# Altium schematic sheet PowerRegulators.SchDoc: Power
size A; Revision: A; SheetNumber: 2; SheetTotal: 6; ECE315_Project_Name: ECE453 F25 Student Mezzanine Template
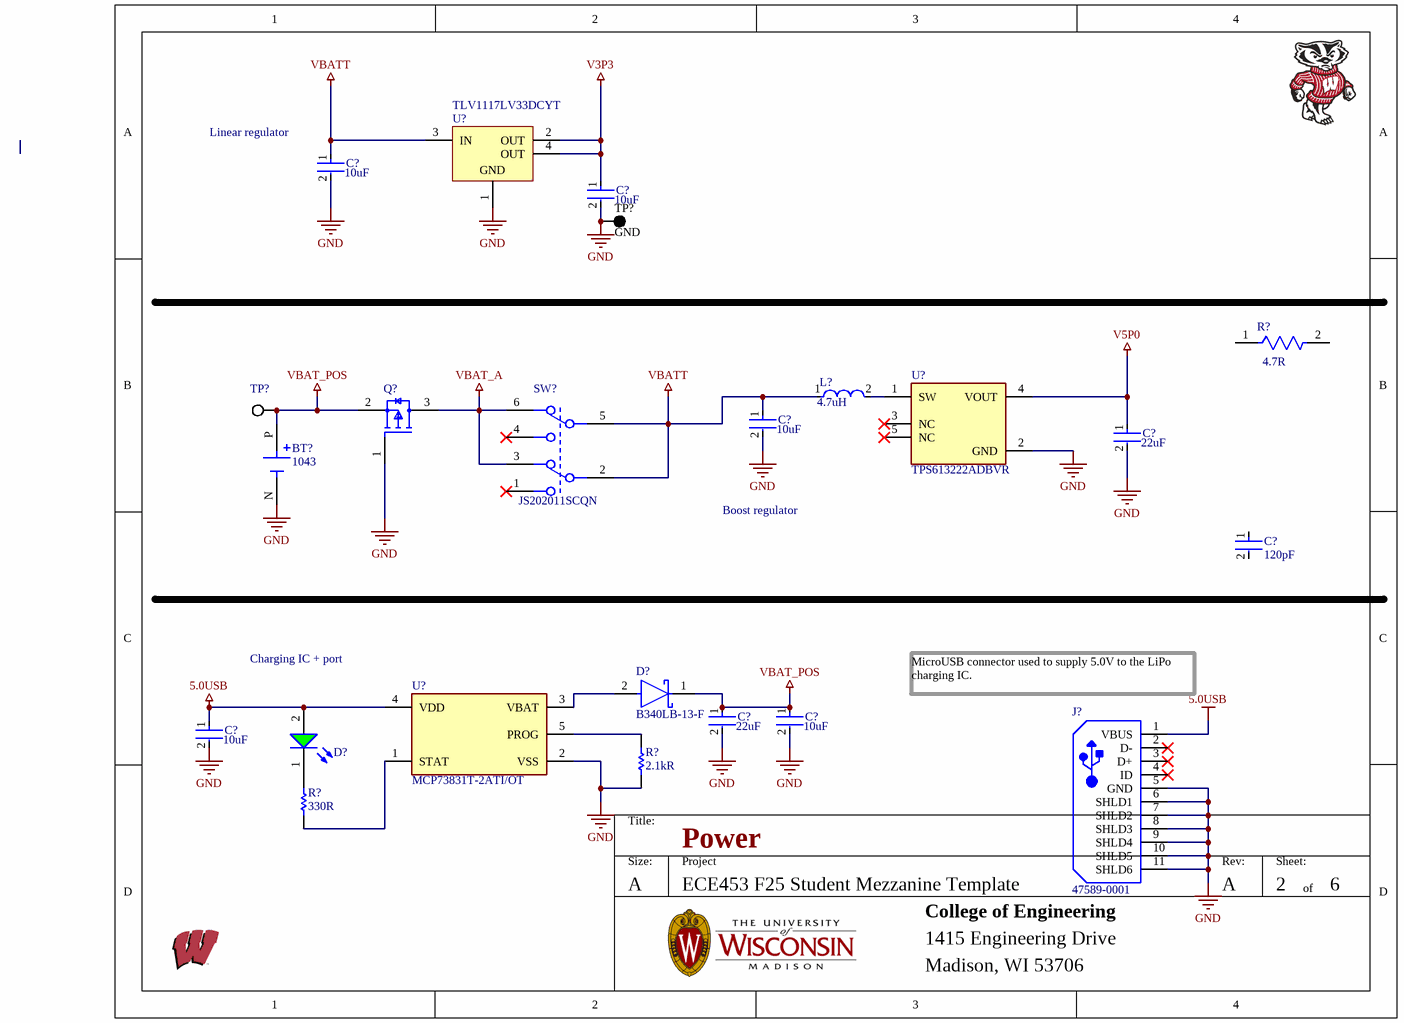
[diagram p0: PowerRegulators.SchDoc]

## Parts
(Parts that share a designator on the sheet are numbered #1, #2 ... from top to bottom, then left to right.)
BT?  1043  [BAT_1043]
C?#1  value 10uF  [FP-C0805C-DG-MFG]  (hidden comment: C0805C106K8PACTU)
C?#2  value 10uF  [FP-C0805C-DG-MFG]  (hidden comment: C0805C106K8PACTU)
C?#3  value 10uF  [FP-C0805C-DG-MFG]  (hidden comment: C0805C106K8PACTU)
C?#4  Capacitance: 22uF  [FP-CL21-IPC_C]  (hidden comment: CL21A226MOCLRNC)
C?#5  Capacitance: 120pF  [FP-CL21-IPC_C]  (hidden comment: CL21C121JDCNNNC)
C?#6  Capacitance: 22uF  [FP-CL21-IPC_C]  (hidden comment: CL21A226MOCLRNC)
C?#7  value 10uF  [FP-C0805C-DG-MFG]  (hidden comment: C0805C106K8PACTU)
C?#8  value 10uF  [FP-C0805C-DG-MFG]  (hidden comment: C0805C106K8PACTU)
D?#1  B340LB-13-F  [FP-SMB-MFG]
D?#2  150080GS75000  [WL-SMCW_0805_150080xx75000]  (value not drawn)
J?  47589-0001  [MOLX-47589-0001_V]
L?  value 4.7uH  [FP-DFE252012C-IPC_C]  (hidden comment: DFE252012P-4R7M=P2)
Q?  DMG2305UX-7  [FP-SOT23-IPC_B]  (value not drawn)
R?#1  Resistance: 4.7R  [FP-RMCF0805-MFG]  (hidden comment: RMCF0805JT4R70)
R?#2  value 330R  [RESC2013X60X40LL20T25]  (hidden comment: ERA6AEB331V)
R?#3  value 2.1kR  [RES_0805]  (hidden comment: RES_0805_K_002_10)
SW?  JS202011SCQN  [FP-JS202011SCQN-MFG]
TP?#1  GND  [KSTN-5011_V]
TP?#2  5019  [KSTN-5019_V]  (value not drawn)
U?#1  TLV1117LV33DCYT  [DCY0004A_M]
U?#2  TPS613222ADBVR  [FP-DBV0005A-MFG]
U?#3  MCP73831T-2ATI/OT  [FP-C04-091-OT-IPC_C]

## Nets
5.0USB: C?#8.1 D?#2.2(A) J?.1(VBUS) U?#3.4(VDD)
GND: BT?.N(NEG) C?#1.2 C?#2.2 C?#3.2 C?#4.2 C?#6.2 C?#7.2 C?#8.2 J?.5(GND) J?.6(SHLD1) J?.7(SHLD2) J?.8(SHLD3) J?.9(SHLD4) J?.10(SHLD5) J?.11(SHLD6) Q?.1(GATE) R?#3.1 TP?#1.1 U?#1.1(GND) U?#2.2(GND) U?#3.2(VSS)
V3P3: C?#2.1 U?#1.2(OUT) U?#1.4(OUT)
V5P0: C?#4.1 U?#2.4(VOUT)
VBAT_A: Q?.3(DRAIN) SW?.3 SW?.6
VBAT_POS: BT?.P(POS) C?#6.1 C?#7.1 D?#1.1(C) Q?.2(SOURCE) TP?#2.1
VBATT: C?#1.1 C?#3.1 L?.1 SW?.2 SW?.5 U?#1.3(IN)
NetD?#1_2: D?#1.2(A) U?#3.3(VBAT)
NetD?#2_1: D?#2.1(K) R?#2.1
NetL?_2: L?.2 U?#2.1(SW)
NetR?#2_2: R?#2.2 U?#3.1(STAT)
NetR?#3_2: R?#3.2 U?#3.5(PROG)

Not connected (* = marked no-connect by the designer): C?#5 1 2; J? 2(D-)* 3(D+)* 4(ID)*; R?#1 1 2; SW? 1* 4*; U?#2 3(NC)* 5(NC)*

## Notes on the sheet
- (near C?#1) Linear regulator
- Boost regulator
- Charging IC + port
- (near J?) MicroUSB connector used to supply 5.0V to the LiPo charging IC.
- Title:
- Size:
- A
- Project
- Rev:
- Sheet:
- of
- College of Engineering
- 1415 Engineering Drive
- Madison, WI 53706

## Library data of the parts
BT? = 1043: Manufacturer: Keystone Electronics; Price: None; Availability: Unavailable; Value: *; MP: 1043; Package: None; Supplier: Digikey; Supplier Part Number: 36-1043-ND; Manufacturer Part Number: 1043; RoHS: Yes; Category: Batteries and Accessories; Stock: 4625; Pricing: 1=3.38, 25=2.604, 100=2.328, 250=2.16176, 500=2.04398, 1000=1.9326, 2500=1.79464, 5000=1.69686 (USD); ComponentLink1URL: https://datasheet.ciiva.com/4/1043-4710.pdf?src-supplier=Digikey; ComponentLink1Description: https://datasheet.ciiva.com/4/1043-4710.pdf?src-supplier=Digikey; ComponentLink2URL: https://datasheet.ciiva.com/3353/1043-eng-tds-3353208.pdf?src-supplier=Distrelec; ComponentLink2Description: https://datasheet.ciiva.com/3353/1043-eng-tds-3353208.pdf?src-supplier=Distrelec; ComponentLink3URL: https://datasheet.ciiva.com/41803/1043-41803215.pdf?src-supplier=Digikey; ComponentLink3Description: https://datasheet.ciiva.com/41803/1043-41803215.pdf?src-supplier=Digikey; ComponentLink4URL: https://datasheet.ciiva.com/4642/1043-4642493.pdf?src-supplier=Mouser; ComponentLink4Description: https://datasheet.ciiva.com/4642/1043-4642493.pdf?src-supplier=Mouser
C?#1-C?#3 C?#7 C?#8 = CMP-2007-03243-2: CAP CER 10UF 10V X5R 0805; Manufacturer: KEMET; Dielectric Material: Ceramic; Material: 4241ConductorMaterial; Tolerance: 10%; ComponentLink2URL: https://content.kemet.com/datasheets/KEM_C1006_X5R_SMD.pdf; ComponentLink2Description: Datasheet; Supplier: Digikey; Supplier Part Number: 399-C0805C106K8PAC7800CT-ND; Manufacturer Part Number: C0805C106K8PACTU; RoHS: Yes; Category: Ceramic Capacitors; Stock: 5202928; Pricing: 1=0.14, 10=0.098, 50=0.0584, 100=0.0459, 500=0.03388, 1000=0.02805 (USD); Mounting Technology: Surface Mount; Case/Package: 0805; Pins: 2; Contact Plating: Tin,Matte; Case Code (Imperial): 0805; Case Code (Metric): 2012; Min Operating Temperature: -55°C; Max Operating Temperature: 85°C; Packaging: Tape and Reel; Dielectric: X5R; Voltage Rating (DC): 10V; Termination: SMD/SMT; Package Quantity: 1; Voltage Rating: 10V; Voltage: 10V; Dissipation Factor: 10%; Series: C; Construction: Flat; Length: 2mm; Width: 0.049inch; Height: 1.25mm; Depth: 1.25mm; Thickness: 0.055inch; Radiation Hardening: No; Reach SVHC Compliant: No; Lead Free: Lead Free; RoHS Compliant: Yes; ComponentLink1URL: https://datasheet.ciiva.com/22704/1732709-22704859.pdf?src-supplier=Element14; ComponentLink1Description: https://datasheet.ciiva.com/22704/1732709-22704859.pdf?src-supplier=Element14; ComponentLink3URL: https://datasheet.ciiva.com/7842/1732709-7842198.pdf?src-supplier=Element14; ComponentLink3Description: https://datasheet.ciiva.com/7842/1732709-7842198.pdf?src-supplier=Element14; ComponentLink4URL: https://datasheet.ciiva.com/7842/40889-7842552.pdf?src-supplier=Element14; ComponentLink4Description: https://datasheet.ciiva.com/7842/40889-7842552.pdf?src-supplier=Element14
C?#4 C?#6 = CMP-13271-002990-1: CL21 Series 0805 22uF 16V ±20% Tolerance X5R Multilayer Ceramic Chip Capacitor; Case Code (Imperial): 0805; Max Operating Temperature: 85°C; Min Operating Temperature: -55°C; Packaging: Tape and Reel; Case Code (Metric): 2012; Case/Package: 0805; Mount: Surface Mount; Tolerance: 20%; Thickness: 0.037inch; Voltage Rating: 16V; Width: 0.049inch; Length: 0.079inch; Supplier: Digikey; Supplier Part Number: 1276-6780-1-ND
C?#5 = CMP-13271-002834-1: CL21 Series 0805 120pF 200V ±5% Tolerance C0G Multilayer Ceramic Chip Capacitor; Case Code (Imperial): 0805; Depth: 1.25mm; Voltage Rating (DC): 200V; Radiation Hardening: No; Packaging: Tape and Reel; Case/Package: 0805; Tolerance: 5%; Height: 0.85mm; Min Operating Temperature: -55°C; Thickness: 0.037inch; Max Operating Temperature: 125°C; Mount: Surface Mount; Package Quantity: 1; Dielectric: C0G; Case Code (Metric): 2012; Length: 2mm; Lead Free: Lead Free; Width: 0.049inch; Voltage Rating: 200V; Supplier: Digikey; Supplier Part Number: 1276-1201-1-ND
D?#1 = CMP-12790-000022-1: DIODE SCHOTTKY 40V 3A SMB; Manufacturer: Diodes Inc.; Max Surge Forward Current: 70A; Value: 180pF; Peak Reverse Current: 2mA; Standoff Height: 0.05mm; Max Junction Temp: +150°C; Forward Voltage: 450mV; Polarity: Standard; Device Class L2: Diodes; Octopart: https://octopart.com/b340lb-13-f-diodes+inc.-325823; Device Class L1: Discrete Semiconductors; Forward Current: 3A; Automotive: No; Manufacturer Part Number: B340LB-13-F; Temperature: -55°C to +150°C; Temperature Range Low: -55°C; Max Repetitive Reverse Voltage: 40V; Device Class L3: Schottky Diodes; RoHS: TRUE; Height: 2.5mm; ComponentLink2URL: https://www.diodes.com/assets/Datasheets/ds30240.pdf; Package: SMB; Digikey Description: DIODE SCHOTTKY 40V 3A SMB; Lead Free: Yes; Category: Diode; Reverse Voltage: 40V; Mouser Description: Schottky Diodes & Rectifiers 40V 3A; ComponentLink2Description: Datasheet; Footprint Url: https://www.diodes.com/assets/Package-Files/SMB.pdf; Temperature Range High: +150°C; Capacitance: 180pF; Supplier: Digikey; Supplier Part Number: B340LB-FDICT-ND; Stock: 98066; Pricing: 1=0.42, 10=0.357, 100=0.2482, 500=0.19376, 1000=0.15748 (USD); Mounting Technology: Surface Mount; Case/Package: SMB; Pins: 2; Weight: 0.00328oz; Min Operating Temperature: -55°C; Max Operating Temperature: 125°C; Max Reverse Current: 2mA; Max Repetitive Reverse Voltage (Vrrm): 40V; Peak Non-Repetitive Surge Current: 70A; Package Quantity: 3000; Packaging: Tape and Reel; Average Rectified Current: 3A; Max Forward Surge Current (Ifsm): 70A; Termination: SMD/SMT; Voltage Rating (DC): 40V; Current Rating: 3A; Output Current: 3A; Current: 3A; Voltage: 40V; Max Reverse Voltage (DC): 40V; Series: -; Length: 4.57mm; Width: 3.94mm; Radiation Hardening: No; Reach SVHC Compliant: No; RoHS Compliant: Yes; ComponentLink1URL: https://datasheet.ciiva.com/4715/ds30240-71143-4715794.pdf?src-supplier=Mouser; ComponentLink1Description: https://datasheet.ciiva.com/4715/ds30240-71143-4715794.pdf?src-supplier=Mouser; ComponentLink3URL: https://datasheet.ciiva.com/26949/getdatasheetpartid-146318-26949355.pdf?src-supplier=Verical; ComponentLink3Description: https://datasheet.ciiva.com/26949/getdatasheetpartid-146318-26949355.pdf?src-supplier=Verical; ComponentLink4URL: https://datasheet.ciiva.com/8303/ds30240-8303077.pdf?src-supplier=Avnet; ComponentLink4Description: https://datasheet.ciiva.com/8303/ds30240-8303077.pdf?src-supplier=Avnet; ComponentLink5URL: https://datasheet.ciiva.com/914/ds30240-914106.pdf?src-supplier=Digikey; ComponentLink5Description: https://datasheet.ciiva.com/914/ds30240-914106.pdf?src-supplier=Digikey; ComponentLink6URL: https://datasheet.ciiva.com/914/ds30240-914107.pdf?src-supplier=Digikey; ComponentLink6Description: https://datasheet.ciiva.com/914/ds30240-914107.pdf?src-supplier=Digikey; ComponentLink7URL: https://datasheet.ciiva.com/914/ds30240-914108.pdf?src-supplier=Digikey; ComponentLink7Description: https://datasheet.ciiva.com/914/ds30240-914108.pdf?src-supplier=Digikey; ComponentLink8URL: https://datasheet.ciiva.com/16380/ds30240-16380877.pdf?src-supplier=Future+Electronics; ComponentLink8Description: https://datasheet.ciiva.com/16380/ds30240-16380877.pdf?src-supplier=Future+Electronics; ComponentLink9URL: https://datasheet.ciiva.com/1177/ds30240-1177479.pdf?src-supplier=Element14; ComponentLink9Description: https://datasheet.ciiva.com/1177/ds30240-1177479.pdf?src-supplier=Element14
D?#2 = CMP-1426-00007-2: LED GREEN CLEAR 0805 SMD; NexarPartId: 29717780; Manufacturer: Wurth Electronics; Wavelength: 520nm; Forward Current: 100mA; Lens Style: Clear, Rectangular; Dominant Wavelength: 525nm; Max Junction Temperature (Tj): 95°C; Power Dissipation: 105mW; Luminous Intensity: 450mcd; Peak Wavelength: 515nm; Viewing Angle: 140°; Test Current: 20mA; Reverse Voltage: 5V; Forward Voltage: 3.2V; Lens Color: Colorless; Lens Size: 1.25mm; Mount: Surface Mount; REACH SVHC: Unknown; Min Operating Temperature: -40°C; Case Code (Imperial): 0805; Case/Package: 0805; Max Operating Temperature: 85°C; RoHS: Compliant; Length: 2mm; Height: 700µm; Width: 1.25mm; Color: Green; Case Code (Metric): 2012; Packaging: Tape and Reel; Max Reverse Voltage (DC): 5V; Supplier: Digikey; Supplier Part Number: 732-4983-1-ND; Manufacturer Part Number: 150080GS75000; Category: LEDs; Stock: 34895; Pricing: 1=0.19, 50=0.176, 100=0.151, 500=0.131 (USD); Mounting Technology: Surface Mount; Package Quantity: 1; Series: WL-SMCW; Lens Transparency: Clear; RoHS Compliant: Yes; Reach SVHC Compliant: Unknown; ComponentLink1URL: https://datasheet.ciiva.com/29563/150080gs75000-29563008.pdf?src-supplier=Digikey; ComponentLink1Description: https://datasheet.ciiva.com/29563/150080gs75000-29563008.pdf?src-supplier=Digikey; ComponentLink2URL: https://datasheet.ciiva.com/29279/759434-da-01-en-chipled-0805-w-kl-gruen-150080gs75000-29279039.pdf?src-supplier=Conrad; ComponentLink2Description: https://datasheet.ciiva.com/29279/759434-da-01-en-chipled-0805-w-kl-gruen-150080gs75000-29279039.pdf?src-supplier=Conrad
J? = CMP-2000-05610-1: Right Angle Female Type AB Micro USB Connector, 30 V, 1.8 A, -30 to 85 degC, RoHS, Tape and Reel; Number of Ports: 1Port; Current Rating: 1.8A; Brand: Molex; Connector Type: MicroUSBTypeABreceptacle; Number of Contacts: 5Contact; Voltage Rating: 30VAC; Plating: 157ConductorMaterial; Max Voltage Rating (AC): 100V; Contact Resistance: 40mR; Voltage Rating (AC): 30V; USB Standard: USB 2.0; Number of Circuits: 5NUMBER; Pitch: 0.65mm; Color: Black; Product: MicroUSBTypeABConnectors; Package URL: http://www.molex.com/pdm_docs/sd/475890001_sd.pdf; Contact Plating: Gold; Datasheet URL: http://www.molex.com/webdocs/datasheets/pdf/en-us/0475890001_IO_CONNECTORS.pdf; Operating Temperature Range: -20Cto+85C; Termination Style: SMD/SMT; Mounting Angle: Right; Package Reference: 47589-0001; Gender: Female; Package Description: Micro USB Connector, Pitch 0.65 mm, 5 Positions, Body 7.5 x 5.6 mm; Mounting Technology: SurfaceMount; Contact Material: CopperAlloy; Packaging: Reel; RoHS: True; Standard: USB; Manufacturer URL: http://www.molex.com/; Manufacturer: Molex; Datasheet Version: 12/2016; Product Category: USBConnectors; Series: 47589; Supplier: Digikey; Supplier Part Number: WM17143CT-ND; Manufacturer Part Number: 47589-0001; Category: USB Connectors; Stock: 36685; Pricing: 1=0.86, 10=0.714, 100=0.5953 (USD); Housing Material: Polymer; Min Operating Temperature: -20°C; Max Operating Temperature: 85°C; Termination: Solder; Orientation: Right Angle; Number of Rows: 1NUMBER; Length: 8.65mm; Radiation Hardening: No; RoHS Compliant: Yes; Reach SVHC Compliant: Unknown; ComponentLink1URL: https://datasheet.ciiva.com/1098/1597783-1098478.pdf?src-supplier=Element14; ComponentLink1Description: https://datasheet.ciiva.com/1098/1597783-1098478.pdf?src-supplier=Element14; ComponentLink2URL: https://datasheet.ciiva.com/11731/0900766b80dfe0a8-11731295.pdf?src-supplier=Rs; ComponentLink2Description: https://datasheet.ciiva.com/11731/0900766b80dfe0a8-11731295.pdf?src-supplier=Rs; ComponentLink3URL: https://datasheet.ciiva.com/15181/getdatasheetpartid-158670-15181214.pdf?src-supplier=Verical; ComponentLink3Description: https://datasheet.ciiva.com/15181/getdatasheetpartid-158670-15181214.pdf?src-supplier=Verical; ComponentLink4URL: https://datasheet.ciiva.com/16148/0475890001-io-connectors-16148921.pdf?src-supplier=Onlinecomponents.com; ComponentLink4Description: https://datasheet.ciiva.com/16148/0475890001-io-connectors-16148921.pdf?src-supplier=Onlinecomponents.com; ComponentLink5URL: https://datasheet.ciiva.com/32371/0475890001-io-connectors-32371755.pdf?src-supplier=Onlinecomponents.com; ComponentLink5Description: https://datasheet.ciiva.com/32371/0475890001-io-connectors-32371755.pdf?src-supplier=Onlinecomponents.com
L? = CMP-06042-011776-1: Shielded Wirewound Inductor 4.7uH 20% 1400mA 0.2Ω 1008 (2520); Manufacturer: Murata; Core Material: Ferrite; Test Frequency: 1MHz; DC Resistance (DCR): 200mR; Max DC Current: 1.4A; Current Rating: 2A; Case Code (Metric): 2520; Case Code (Imperial): 1008; Inductance: 4.7uH; Mount: Surface Mount; Packaging: Tape and Reel; Depth: 2mm; Length: 0.098inch; Case/Package: 1008; Max Operating Temperature: 125°C; Shielding: Shielded; Width: 0.079inch; Height - Seated (Max): 0.047inch; Tolerance: 20%; Min Operating Temperature: -40°C; Resistor Type: Wirewound; Supplier: Digikey; Supplier Part Number: 490-10651-1-ND; Manufacturer Part Number: DFE252012P-4R7M=P2; RoHS: Yes; Category: Fixed Inductors; Stock: 3626; Pricing: 1=0.28, 10=0.228, 25=0.21, 50=0.1926, 100=0.1698, 250=0.1646, 500=0.14708, 1000=0.11907 (USD); Mounting Technology: Surface Mount; Series: DFE252012P; RoHS Compliant: Yes; ComponentLink1URL: http://www.farnell.com/datasheets/2550138.pdf?src-supplier=Farnell; ComponentLink1Description: http://www.farnell.com/datasheets/2550138.pdf?src-supplier=Farnell; ComponentLink2URL: http://www.murata.com/~/media/webrenewal/products/inductor/chip/tokoproducts/wirewoundmetalalloychiptype/m_dfe252012p.ashx?src-supplier=Digikey; ComponentLink2Description: http://www.murata.com/~/media/webrenewal/products/inductor/chip/tokoproducts/wirewoundmetalalloychiptype/m_dfe252012p.ashx?src-supplier=Digikey; ComponentLink3URL: https://www.murata.com/~/media/webrenewal/products/inductor/chip/tokoproducts/wirewoundmetalalloychiptype/m_dfe252012p.ashx?src-supplier=Digikey; ComponentLink3Description: https://www.murata.com/~/media/webrenewal/products/inductor/chip/tokoproducts/wirewoundmetalalloychiptype/m_dfe252012p.ashx?src-supplier=Digikey; ComponentLink4URL: http://www.toko.co.jp/products/pdf/inductors/dfe252012p.pdf?src-supplier=Avnet; ComponentLink4Description: http://www.toko.co.jp/products/pdf/inductors/dfe252012p.pdf?src-supplier=Avnet; ComponentLink5URL: https://datasheet.octopart.com/DFE252012P-4R7M%3DP2-Murata-Power-Solutions-datasheet-120059230.pdf?src-supplier=Future+Electronics; ComponentLink5Description: https://datasheet.octopart.com/DFE252012P-4R7M%3DP2-Murata-Power-Solutions-datasheet-120059230.pdf?src-supplier=Future+Electronics; ComponentLink6URL: http://www.farnell.com/datasheets/2550138.pdf?src-supplier=Newark; ComponentLink6Description: http://www.farnell.com/datasheets/2550138.pdf?src-supplier=Newark; ComponentLink7URL: https://datasheet.octopart.com/DFE252012P-4R7M%3DP2-Murata-datasheet-62290040.pdf?src-supplier=Element14; ComponentLink7Description: https://datasheet.octopart.com/DFE252012P-4R7M%3DP2-Murata-datasheet-62290040.pdf?src-supplier=Element14; ComponentLink8URL: https://datasheet.octopart.com/DFE252012P-4R7M%3DP2-Murata-datasheet-142045614.pdf?src-supplier=Arrow.cn; ComponentLink8Description: https://datasheet.octopart.com/DFE252012P-4R7M%3DP2-Murata-datasheet-142045614.pdf?src-supplier=Arrow.cn
Q? = CMP-1693-00002-4: MOSFET P-CH 20V 4.2A SOT23; Manufacturer: Diodes; Turn-On Delay Time: 10.8ns; Turn-Off Delay Time: 79.3ns; Threshold Voltage: -900mV; Rise Time: 13.7ns; Gate to Source Voltage (Vgs): 8V; Rds On Max: 52mR; Element Configuration: Single; Fall Time: 34.7ns; Max Power Dissipation: 1.4W; Drain to Source Resistance: 200mR; Number of Channels: 1; Input Capacitance: 808pF; Polarity: P-CHANNEL; Drain to Source Breakdown Voltage: -20V; Lead Free: Lead Free; Number of Pins: 3; Length: 3mm; Continuous Drain Current (ID): 4.2A; Contact Plating: Tin; Mount: Surface Mount; Weight: 0.000282oz; Min Operating Temperature: -55°C; Package Quantity: 3000; Drain to Source Voltage (Vdss): 20V; On-State Resistance: 52MR; Max Operating Temperature: 150°C; Height: 1.1mm; REACH SVHC: No SVHC; Packaging: Tape and Reel; Radiation Hardening: No; Case/Package: SOT-23; Width: 1.4mm; Supplier: Digikey; Supplier Part Number: DMG2305UX-7DICT-ND; Manufacturer Part Number: DMG2305UX-7; RoHS: Yes; Category: MOSFETs; Stock: 261910; Pricing: 1=0.39, 10=0.27, 100=0.1315, 500=0.10972, 1000=0.07623 (USD); Mounting Technology: Surface Mount; Pins: 3; Series: -; Drain-source On Resistance-Max: 52MR; Power Dissipation: 1.4W; Reach SVHC Compliant: No; RoHS Compliant: Yes; ComponentLink1URL: https://datasheet.ciiva.com/26993/dmg2305ux-26993544.pdf?src-supplier=Future+Electronics; ComponentLink1Description: https://datasheet.ciiva.com/26993/dmg2305ux-26993544.pdf?src-supplier=Future+Electronics
R?#1 = CMP-26527-005191-1: 4.7Ω ±5% 0.125W 0805 Thick Film Chip Resistor AEC-Q200 compliant; Temperature Coefficient: 200ppm/°C; Max Power Dissipation: 125mW; Height: 0.026inch; RoHS Compliant: Yes; Length: 0.079inch; Features: Automotive AEC-Q200; Case Code (Metric): 2012; Radiation Hardening: No; Case Code (Imperial): 0805; Resistor Type: Thick Film; Contact Plating: Tin; Tolerance: 5%; Packaging: Tape and Reel; Max Operating Temperature: 155°C; Number of Terminations: 2; Series: RMCF; Width: 0.049inch; Case/Package: 0805; Min Operating Temperature: -55°C; Mount: Surface Mount; Lead Free: Lead Free; Supplier: Digikey; Supplier Part Number: RMCF0805JT4R70CT-ND
R?#2 = CMP-2001-00628-1: RES SMD 330 OHM 1% 1/8W 0805; Manufacturer: Panasonic; Manufacturer Part Number: ERA-6AEB331V; Power Rating: 125mW; Tolerance: 0.1%; Temperature Coefficient: 25ppm/°C; Voltage Rating: 100V; Part Number: ERA6AEB331V; Supplier: Digikey; Supplier Part Number: P330DACT-ND; RoHS: Yes; Category: Chip SMD Resistors; Stock: 4222; Pricing: 1=0.32, 10=0.256, 50=0.1422, 100=0.1, 500=0.06374, 1000=0.04413 (USD); Mounting Technology: Surface Mount; Case/Package: 0805; Pins: 2; Case Code (Imperial): 0805; Case Code (Metric): 2012; Contact Plating: Tin; Weight: 0.000194oz; Min Operating Temperature: -55°C; Max Operating Temperature: 155°C; Packaging: Tape and Reel; Resistor Type: Thin Film,Metal Film; Termination: SMD/SMT; Series: ERA; Resistance Tolerance: 0.1%; Technology: METAL FILM; Package Quantity: 1; Number of Terminations: 2; Max Power Dissipation: 125mW; Voltage Rating (DC): 100V; Features: Automotive AEC-Q200; Length: 2mm; Width: 1.25mm; Height: 0.5mm; Depth: 1.25mm; Ratings: AEC-Q200; Reach SVHC Compliant: No; RoHS Compliant: Yes; Lead Free: Lead Free; ComponentLink1URL: https://datasheet.ciiva.com/11808/0900766b80eb1d8c-11808093.pdf?src-supplier=Rs; ComponentLink1Description: https://datasheet.ciiva.com/11808/0900766b80eb1d8c-11808093.pdf?src-supplier=Rs; ComponentLink2URL: https://datasheet.ciiva.com/29184/452857-da-01-en-widerstand-0805-era-29184079.pdf?src-supplier=Conrad; ComponentLink2Description: https://datasheet.ciiva.com/29184/452857-da-01-en-widerstand-0805-era-29184079.pdf?src-supplier=Conrad; ComponentLink3URL: https://datasheet.ciiva.com/9182/aoa0000ce26-9182968.pdf?src-supplier=Avnet; ComponentLink3Description: https://datasheet.ciiva.com/9182/aoa0000ce26-9182968.pdf?src-supplier=Avnet; ComponentLink4URL: https://datasheet.ciiva.com/48536/era-eng-tds-48536857.pdf?src-supplier=Distrelec; ComponentLink4Description: https://datasheet.ciiva.com/48536/era-eng-tds-48536857.pdf?src-supplier=Distrelec; ComponentLink5URL: https://datasheet.ciiva.com/22759/485442-22759176.pdf?src-supplier=Farnell; ComponentLink5Description: https://datasheet.ciiva.com/22759/485442-22759176.pdf?src-supplier=Farnell; ComponentLink6URL: https://datasheet.ciiva.com/6138/485442-6138589.pdf?src-supplier=Farnell; ComponentLink6Description: https://datasheet.ciiva.com/6138/485442-6138589.pdf?src-supplier=Farnell; ComponentLink7URL: https://datasheet.ciiva.com/43457/485442-43457816.pdf?src-supplier=Farnell; ComponentLink7Description: https://datasheet.ciiva.com/43457/485442-43457816.pdf?src-supplier=Farnell; ComponentLink8URL: https://datasheet.ciiva.com/6138/485442-6138585.pdf?src-supplier=Farnell; ComponentLink8Description: https://datasheet.ciiva.com/6138/485442-6138585.pdf?src-supplier=Farnell; ComponentLink9URL: https://datasheet.ciiva.com/24164/aoa0000ce26-197354-24164407.pdf?src-supplier=Mouser; ComponentLink9Description: https://datasheet.ciiva.com/24164/aoa0000ce26-197354-24164407.pdf?src-supplier=Mouser; ComponentLink10URL: https://datasheet.ciiva.com/22744/1776116-22744153.pdf?src-supplier=Element14; ComponentLink10Description: https://datasheet.ciiva.com/22744/1776116-22744153.pdf?src-supplier=Element14; ComponentLink11URL: https://datasheet.ciiva.com/46436/485442-46436606.pdf?src-supplier=Element14; ComponentLink11Description: https://datasheet.ciiva.com/46436/485442-46436606.pdf?src-supplier=Element14; ComponentLink12URL: https://datasheet.ciiva.com/16777/70068849-16777611.pdf?src-supplier=Allied+Electronics; ComponentLink12Description: https://datasheet.ciiva.com/16777/70068849-16777611.pdf?src-supplier=Allied+Electronics; ComponentLink13URL: https://datasheet.ciiva.com/30237/54aoa0000ce26-30237450.pdf?src-supplier=Onlinecomponents.com; ComponentLink13Description: https://datasheet.ciiva.com/30237/54aoa0000ce26-30237450.pdf?src-supplier=Onlinecomponents.com
R?#3 = RES_0805_K_002_10: Res Thick Film 0805 2.1K Ohm 1% 1/8W ±100ppm/°C Molded SMD Punched Carrier T/R; Manufacturer: Panasonic; Manufacturer Part Number: ERJ-6ENF2101V; Power Rating: 125mW; Voltage Rating: 150V; RoHS: Yes; Category: Chip SMD Resistors; Stock: 313553; Pricing: 1=0.11, 10=0.053, 50=0.0344, 100=0.0292, 500=0.02058, 1000=0.01792 (USD); Mounting Technology: Surface Mount; Case/Package: 0805; Contact Plating: Tin; Case Code (Metric): 2012; Case Code (Imperial): 0805; Weight: 0.000194oz; Min Operating Temperature: -55°C; Max Operating Temperature: 155°C; Tolerance: 1%; Resistor Type: Thick Film; Temperature Coefficient: 100ppm/°C; Packaging: Tape and Reel; Package Quantity: 1; Number of Terminations: 2; Termination: SMD/SMT; Max Power Dissipation: 125mW; Voltage Rating (DC): 150V; Features: Automotive AEC-Q200; Series: ERJ; Resistance Tolerance: 1%; Technology: THICK FILM; Length: 2mm; Width: 1.2mm; Height: 0.6mm; Depth: 1.25mm; Reach SVHC Compliant: Yes; Lead Free: Lead Free; RoHS Compliant: Yes; ComponentLink1URL: https://datasheet.ciiva.com/11821/0900766b80f80784-11821615.pdf?src-supplier=Rs; ComponentLink1Description: https://datasheet.ciiva.com/11821/0900766b80f80784-11821615.pdf?src-supplier=Rs; ComponentLink2URL: https://datasheet.ciiva.com/30263/aoa0000ce2-30263353.pdf?src-supplier=Onlinecomponents.com; ComponentLink2Description: https://datasheet.ciiva.com/30263/aoa0000ce2-30263353.pdf?src-supplier=Onlinecomponents.com; ComponentLink3URL: https://datasheet.ciiva.com/22668/1678782-22668183.pdf?src-supplier=Element14; ComponentLink3Description: https://datasheet.ciiva.com/22668/1678782-22668183.pdf?src-supplier=Element14; ComponentLink4URL: https://datasheet.ciiva.com/46372/1678782-46372875.pdf?src-supplier=Element14; ComponentLink4Description: https://datasheet.ciiva.com/46372/1678782-46372875.pdf?src-supplier=Element14; ComponentLink5URL: https://datasheet.ciiva.com/46372/1678782-46372876.pdf?src-supplier=Element14; ComponentLink5Description: https://datasheet.ciiva.com/46372/1678782-46372876.pdf?src-supplier=Element14; ComponentLink6URL: https://datasheet.ciiva.com/28548/1694929-28548569.pdf?src-supplier=Element14; ComponentLink6Description: https://datasheet.ciiva.com/28548/1694929-28548569.pdf?src-supplier=Element14; ComponentLink7URL: https://datasheet.ciiva.com/24165/aoa0000ce2-24165851.pdf?src-supplier=Mouser; ComponentLink7Description: https://datasheet.ciiva.com/24165/aoa0000ce2-24165851.pdf?src-supplier=Mouser; Supplier 1: Digikey; Supplier Part Number 1: P2.10KCCT-ND
SW? = CMP-2000-05087-3: SWITCH SLIDE DPDT 300MA 6V; Manufacturer: ITT C&K; Switch Function: On-On; Actuator Type: Standard; Switch Travel: 2mm; Actuator Color: Black; Contact Resistance: 70mR; Electrical Life: 5000Cycles; Actuator Material: Nylon; REACH SVHC: No SVHC; Series: JS; Min Operating Temperature: -20°C; Depth: 7.5mm; Housing Material: Nylon; Voltage Rating (DC): 6V; Max Operating Temperature: 85°C; Contact Current Rating: 300mA; Package Quantity: 1; Contact Plating: Silver; Contact Material: Copper Alloy; Throw Configuration: DPDT; Current Rating: 300mA; Orientation: Vertical; Max Current Rating: 300mA; Max Voltage Rating (DC): 6V; Flammability Rating: UL94 V-2; Length: 9mm; Packaging: Tape and Reel; Mount: Surface Mount; Actuator Length: 2mm; Lead Free: Lead Free; Termination: Gull Wing; Radiation Hardening: No; Supplier: Digikey; Supplier Part Number: 401-2002-1-ND; Manufacturer Part Number: JS202011SCQN; RoHS: Yes; Category: Slide Switches; Stock: 32678; Pricing: 1=0.64, 10=0.619, 25=0.596, 100=0.5159, 250=0.47, 500=0.43562 (USD); Mounting Technology: Surface Mount; Reach SVHC Compliant: No; RoHS Compliant: Yes; ComponentLink1URL: https://datasheet.ciiva.com/2889/js-29aug13-2889127.pdf?src-supplier=Digikey; ComponentLink1Description: https://datasheet.ciiva.com/2889/js-29aug13-2889127.pdf?src-supplier=Digikey; ComponentLink2URL: https://datasheet.ciiva.com/23829/1707718-23829488.pdf?src-supplier=Newark; ComponentLink2Description: https://datasheet.ciiva.com/23829/1707718-23829488.pdf?src-supplier=Newark; ComponentLink3URL: https://datasheet.ciiva.com/2889/js-15sept15-2889128.pdf?src-supplier=Digikey; ComponentLink3Description: https://datasheet.ciiva.com/2889/js-15sept15-2889128.pdf?src-supplier=Digikey; ComponentLink4URL: https://datasheet.ciiva.com/8625/js-9dec14-8625470.pdf?src-supplier=Avnet; ComponentLink4Description: https://datasheet.ciiva.com/8625/js-9dec14-8625470.pdf?src-supplier=Avnet; ComponentLink5URL: https://datasheet.ciiva.com/22630/1707718-22630697.pdf?src-supplier=Element14; ComponentLink5Description: https://datasheet.ciiva.com/22630/1707718-22630697.pdf?src-supplier=Element14; ComponentLink6URL: https://datasheet.ciiva.com/2889/js-15sept15-2889129.pdf?src-supplier=Digikey; ComponentLink6Description: https://datasheet.ciiva.com/2889/js-15sept15-2889129.pdf?src-supplier=Digikey
TP?#1 = CMP-1672-00003-4: Test Point, Black, Through Hole, RoHS, Bulk; Manufacturer: Keystone; Manufacturer Part Number: 5011; Body Material: PBT; Gender: Female; Hole Diameter: 1.6mm; Inside Diameter: 1.78mm; Number of Ports: 1; ComponentLink2URL: http://www.keyelco.com/product-pdf.cfm?p=1320; Colour: Black; Pins: 1; REACH SVHC: No SVHC; ComponentLink1URL: http://www.keyelco.com/; PackageReference: 5011; Contact Plating: Silver; Package Quantity: 100; Packaging: Bulk; RoHSCompliant: true; Height: 8.12 mm; PackageDescription: 1-Pin Through Hole Device, Dia 3.17 mm; Mount: Through Hole; Mounting Technology: Through Hole; DatasheetVersion: Rev. F, 12/2013; ComponentLink1Description: Manufacturer URL; Contact Material: Bronze; ComponentLink2Description: Datasheet; Supplier: DigiKey; Supplier Part Number: 36-5011-ND; RoHS: Compliant; Category: Connectors; Stock: 195358; Pricing: 1=0.33, 10=0.245, 25=0.2196, 100=0.19, 2500=0.16, 5000=0.14 (USD); Case/Package: 5011; Color: Black; Flammability Rating: UL94 V-0; Housing Color: Black; Lead Free: Lead Free; Length: 11.3mm; Lifecycle Status: Production; Material: Bronze, Nylon, Silver; Orientation: Straight; ComponentLink3URL: https://datasheet.octopart.com:443/5011-Keystone-datasheet-111020742.pdf?src-supplier=IHS; ComponentLink3Description: https://datasheet.octopart.com:443/5011-Keystone-datasheet-111020742.pdf?src-supplier=IHS; ComponentLink4URL: https://datasheet.octopart.com:443/5011-Keystone-datasheet-15716159.pdf?src-supplier=Farnell; ComponentLink4Description: https://datasheet.octopart.com:443/5011-Keystone-datasheet-15716159.pdf?src-supplier=Farnell; ComponentLink5URL: https://datasheet.octopart.com:443/5011-Keystone-datasheet-23674.pdf?src-supplier=element14; ComponentLink5Description: https://datasheet.octopart.com:443/5011-Keystone-datasheet-23674.pdf?src-supplier=element14; ComponentLink6URL: https://datasheet.octopart.com:443/5011-Keystone-datasheet-60278094.pdf?src-supplier=LKR; ComponentLink6Description: https://datasheet.octopart.com:443/5011-Keystone-datasheet-60278094.pdf?src-supplier=LKR; ComponentLink7URL: https://datasheet.octopart.com:443/5011-Keystone-datasheet-9590016.pdf?src-supplier=Sager+Electronics; ComponentLink7Description: https://datasheet.octopart.com:443/5011-Keystone-datasheet-9590016.pdf?src-supplier=Sager+Electronics; ComponentLink8URL: https://datasheet.octopart.com:443/5011-Keystone-datasheet-15983578.pdf?src-supplier=element14+APAC; ComponentLink8Description: https://datasheet.octopart.com:443/5011-Keystone-datasheet-15983578.pdf?src-supplier=element14+APAC; ComponentLink9URL: https://datasheet.octopart.com:443/5011-Keystone-datasheet-120100763.pdf?src-supplier=Megastar; ComponentLink9Description: https://datasheet.octopart.com:443/5011-Keystone-datasheet-120100763.pdf?src-supplier=Megastar; ComponentLink10URL: https://datasheet.octopart.com:443/5011-Keystone-datasheet-10925273.pdf?src-supplier=RS+(Formerly+Allied+Electronics); ComponentLink10Description: https://datasheet.octopart.com:443/5011-Keystone-datasheet-10925273.pdf?src-supplier=RS+(Formerly+Allied+Electronics); ComponentLink11URL: https://datasheet.octopart.com:443/5011-Keystone-datasheet-6528.pdf?src-supplier=RS+(Formerly+Allied+Electronics); ComponentLink11Description: https://datasheet.octopart.com:443/5011-Keystone-datasheet-6528.pdf?src-supplier=RS+(Formerly+Allied+Electronics); ComponentLink12URL: https://datasheet.octopart.com:443/5011-Keystone-datasheet-549598.pdf?src-supplier=Future+Electronics; ComponentLink12Description: https://datasheet.octopart.com:443/5011-Keystone-datasheet-549598.pdf?src-supplier=Future+Electronics; ComponentLink13URL: https://datasheet.octopart.com:443/5011-Keystone-datasheet-528293.pdf?src-supplier=Future+Electronics; ComponentLink13Description: https://datasheet.octopart.com:443/5011-Keystone-datasheet-528293.pdf?src-supplier=Future+Electronics
TP?#2 = CMP-1672-00008-1: Test Point, 1 Position SMD, RoHS, Tape and Reel; Manufacturer: Keystone Electronics; Plating: Silver; Body Material: Bronze; Supplier: Newark; Supplier Part Number: 59Y8500; Manufacturer Part Number: 5019; RoHS: Yes; Category: Connectors; Stock: 11269; Pricing: 1=0.411, 10=0.389, 25=0.285, 50=0.279, 100=0.273, 250=0.246 (USD); Mounting Technology: Surface Mount,PCB; Pins: 1; Contact Plating: Silver; Contact Material: Bronze; Material: Bronze; Packaging: Tape and Reel; Package Quantity: 1; Termination: SMD/SMT; Series: 5019; Height: 0.09inch; Reach SVHC Compliant: No; RoHS Compliant: Yes; Lead Free: Lead Free; ComponentLink1URL: https://datasheet.ciiva.com/14848/m60-2p61-14848437.pdf?src-supplier=Digi-Key; ComponentLink1Description: https://datasheet.ciiva.com/14848/m60-2p61-14848437.pdf?src-supplier=Digi-Key; ComponentLink2URL: https://datasheet.ciiva.com/14848/m60-2p61-14848438.pdf?src-supplier=Digi-Key; ComponentLink2Description: https://datasheet.ciiva.com/14848/m60-2p61-14848438.pdf?src-supplier=Digi-Key; ComponentLink3URL: https://datasheet.ciiva.com/14848/m60-2p61-14848439.pdf?src-supplier=Digi-Key; ComponentLink3Description: https://datasheet.ciiva.com/14848/m60-2p61-14848439.pdf?src-supplier=Digi-Key; ComponentLink4URL: https://datasheet.ciiva.com/16318/m60-2p61-16318395.pdf?src-supplier=Future+Electronics; ComponentLink4Description: https://datasheet.ciiva.com/16318/m60-2p61-16318395.pdf?src-supplier=Future+Electronics; ComponentLink5URL: https://datasheet.ciiva.com/16885/70182998-16885945.pdf?src-supplier=Allied+Electronics; ComponentLink5Description: https://datasheet.ciiva.com/16885/70182998-16885945.pdf?src-supplier=Allied+Electronics
U?#1 = CMP-0395-00499-2: Single Output LDO, 1 A, Fixed 3.3 V Output, 2 to 5.5 V Input, 4-pin SOT-223 (DCY), -40 to 125 degC, Green (RoHS & no Sb/Br); Manufacturer: Texas Instruments; Vout Adj(Max)(V): 3.3; Iout(Max)(A): 1; SubFamily: Single Channel LDO; Iq(Typ)(mA): 0.05; Accuracy(%): 2; Vin(Max)(V): 5.5; Vdo(Typ)(mV): 1200; Max Power Dissipation: 1.59W; Dropout Voltage: 455mV; Output Voltage: 3.3V; Output Current: 1A; Max Supply Voltage: 5.5V; Min Input Voltage: 2V; Min Current Limit: 1.1A; Polarity: Positive; Quiescent Current: 50uA; Accuracy: 2%; Power Supply Rejection Ratio (PSRR): 75dB; PartNumber: TLV1117LV33DCYT; PackageReference: DCY0004A; PackageVersion: 4202506/B; ComponentLink1URL: http://www.ti.com/; DatasheetVersion: SBVS160A; Mounting Technology: Surface Mount; Fixed Output Options(V): 3.3; ComponentLink3Description: Package Specification; PackageDescription: 4-Pin Plastic Small Outline, Body 3.5 x 6.5 mm, Pitch 2.3 mm; Vout Adj(Min)(V): 3.3; ComponentLink2URL: http://www.ti.com/general/docs/lit/getliterature.tsp?genericPartNumber=TLV1117LV33&fileType=pdf; Code_JEDEC: TO-261; ComponentLink1Description: Manufacturer URL; Vin(Min)(V): 2; ComponentLink2Description: Datasheet; Eco-Plan: Green (RoHS & no Sb/Br); ComponentLink3URL: http://www.ti.com/litv/pdf/mpds094a; Supplier: Digikey; Supplier Part Number: 296-TLV1117LV33DCYTCT-ND; Manufacturer Part Number: TLV1117LV33DCYT; RoHS: Yes; Category: Voltage Regulators - Linear; Stock: 4630; Pricing: 1=1.26, 10=1.126, 25=1.0688, 100=0.8781 (USD); Case/Package: SOT-223; Pins: 4; Min Operating Temperature: -40°C; Max Operating Temperature: 125°C; Package Quantity: 250; Packaging: Tape and Reel; Number of Outputs: 1; Nominal Output Voltage: 3.3V; Max Output current: 1A; Number of Regulators: 1; Max Output Voltage: 3.3V; Min Output Voltage: 3.3V; Output Type: Fixed; Series: -; Output Configuration: Positive; Radiation Hardening: No; Reach SVHC Compliant: No; Lead Free: Lead Free; RoHS Compliant: Yes; ComponentLink4URL: http://components.arrow.com/part/dataview/51117919S8954709N7713?src-supplier=Arrow+Electronics; ComponentLink4Description: http://components.arrow.com/part/dataview/51117919S8954709N7713?src-supplier=Arrow+Electronics; ComponentLink5URL: http://www.ti.com/general/docs/lit/getliterature.tsp?genericPartNumber=TLV1117LV&&fileType=pdf&src-supplier=Farnell; ComponentLink5Description: http://www.ti.com/general/docs/lit/getliterature.tsp?genericPartNumber=TLV1117LV&&fileType=pdf&src-supplier=Farnell; ComponentLink6URL: http://www.farnell.com/datasheets/1950591.pdf?src-supplier=Element14; ComponentLink6Description: http://www.farnell.com/datasheets/1950591.pdf?src-supplier=Element14; ComponentLink7URL: http://www.ti.com/lit/ds/symlink/tlv1117lv.pdf?src-supplier=Digikey; ComponentLink7Description: http://www.ti.com/lit/ds/symlink/tlv1117lv.pdf?src-supplier=Digikey; ComponentLink8URL: http://www.ti.com/general/docs/suppproductinfo.tsp?distId=10&amp;gotoUrl=http%3A%2F%2Fwww.ti.com%2Flit%2Fgpn%2Ftlv1117lv&src-supplier=Digikey; ComponentLink8Description: http://www.ti.com/general/docs/suppproductinfo.tsp?distId=10&amp;gotoUrl=http%3A%2F%2Fwww.ti.com%2Flit%2Fgpn%2Ftlv1117lv&src-supplier=Digikey; ComponentLink9URL: http://www.ti.com/lit/gpn/tlv1117lv?src-supplier=Mouser; ComponentLink9Description: http://www.ti.com/lit/gpn/tlv1117lv?src-supplier=Mouser; ComponentLink10URL: http://www.ti.com/general/docs/lit/getliterature.tsp?genericPartNumber=TLV1117LV&&fileType=pdf&src-supplier=Avnet; ComponentLink10Description: http://www.ti.com/general/docs/lit/getliterature.tsp?genericPartNumber=TLV1117LV&&fileType=pdf&src-supplier=Avnet
U?#2 = CMP-04918-000049-1: IC REG BOOST 5V 2.5A SOT23-5; Manufacturer: Texas Instruments; Output Current: 1.8A; Standoff Height: 0mm; Max Junction Temp: +125°C; Switching Frequency: 2000kHz; Output Type: Fixed; Nominal Supply Current: 6.5uA; Min Supply Voltage: 0.9V; Number Of Outputs: 1; Max Supply Voltage: 5.5V; Max Duty Cycle: 90%; Output Configuration: Positive; Min Input Voltage: 900mV; Synchronous Rectifier: Yes; Device Class L1: Integrated Circuits (ICs); Mouser Description: 6-uA Quiescent Current, 1.8-A Switch Current Boost Converter 5-SOT-23 -40 to 85; Lead Free: Yes; ComponentLink2Description: Datasheet; Digikey Description: IC REG BOOST 5V 2.5A SOT23-5; Temperature Range High: +85°C; Manufacturer Part Number: TPS613222ADBVR; Device Class L3: Voltage Regulators - Switching; RoHS: TRUE; Ipc Land Pattern Name: SOT95P280X145-5; Switching Topology: Boost; Device Class L2: Power Management ICs; Height: 1.45mm; Output Voltage: 5V; ComponentLink2URL: http://www.ti.com/lit/ds/symlink/tps61322.pdf; Octopart: https://octopart.com/tps613222adbvr-texas+instruments-88135761; Temperature: -40°C to +85°C; Automotive: No; Package: DBV0005A; Temperature Range Low: -40°C; Category: IC; Supplier: Digikey; Supplier Part Number: 296-50503-1-ND; Stock: 7920; Pricing: 1=0.58, 10=0.492, 25=0.4596, 100=0.3676, 250=0.34136, 500=0.28886, 1000=0.22321 (USD); Mounting Technology: Surface Mount; Case/Package: SOT-23-5; Pins: 5; Min Operating Temperature: -40°C; Max Operating Temperature: 85°C; Topology: Boost; Packaging: Cut Tape; Min Output Voltage: 5V; Series: -; Length: 2.9mm; Width: 1.6mm; Thickness: 1.2mm; RoHS Compliant: Yes; ComponentLink1URL: https://datasheet.ciiva.com/70834/tps61322-70834095.pdf?src-supplier=Digikey; ComponentLink1Description: https://datasheet.ciiva.com/70834/tps61322-70834095.pdf?src-supplier=Digikey
U?#3 = CMP-0133-00144-2: IC CONTROLLR LI-ION 4.2V SOT23-5; Manufacturer: Microchip; Max Supply Voltage: 6V; Max Output Current: 500mA; Min Output Voltage: 4.168V; Max Output Voltage: 4.232V; Min Supply Voltage: 3.75V; Number of Cells: 1; Fault Protection: Over Voltage; Lead Free: Lead Free; Number of Pins: 5; Package Quantity: 3000; Min Operating Temperature: -40°C; Width: 1.8mm; Max Charge Current: 500mA; Output Current: 500mA; Packaging: Tape and Reel; Height: 1.3mm; Output Voltage: 4.2V; Max Operating Temperature: 85°C; Mount: Surface Mount; Case/Package: SOT-23; Length: 3.1mm; REACH SVHC: No SVHC; Supplier: Digikey; Supplier Part Number: MCP73831T-2ATI/OTCT-ND; Manufacturer Part Number: MCP73831T-2ATI/OT; RoHS: Yes; Category: Battery Management; Stock: 14564; Pricing: 1=0.76, 25=0.63, 100=0.6125 (USD); Mounting Technology: Surface Mount; Pins: 5; Series: -; Battery Pack Voltage: 4.2V; Reach SVHC Compliant: No; RoHS Compliant: Yes; ComponentLink1URL: http://www.microchip.com/mymicrochip/filehandler.aspx?ddocname=en023833&src-supplier=Distrelec; ComponentLink1Description: http://www.microchip.com/mymicrochip/filehandler.aspx?ddocname=en023833&src-supplier=Distrelec; ComponentLink2URL: http://www.microchip.com/mymicrochip/filehandler.aspx?ddocname=en023833&src-supplier=Mouser; ComponentLink2Description: http://www.microchip.com/mymicrochip/filehandler.aspx?ddocname=en023833&src-supplier=Mouser; ComponentLink3URL: http://www.microchip.com/mymicrochip/filehandler.aspx?ddocname=en023833&src-supplier=Rs; ComponentLink3Description: http://www.microchip.com/mymicrochip/filehandler.aspx?ddocname=en023833&src-supplier=Rs; ComponentLink4URL: http://www.microchip.com/mymicrochip/filehandler.aspx?ddocname=en023833&src-supplier=Freelance+Electronics; ComponentLink4Description: http://www.microchip.com/mymicrochip/filehandler.aspx?ddocname=en023833&src-supplier=Freelance+Electronics; ComponentLink5URL: http://www.microchip.com/mymicrochip/filehandler.aspx?ddocname=en023833&src-supplier=Electro+Sonic; ComponentLink5Description: http://www.microchip.com/mymicrochip/filehandler.aspx?ddocname=en023833&src-supplier=Electro+Sonic; ComponentLink6URL: http://www.microchip.com/mymicrochip/filehandler.aspx?ddocname=en023833&src-supplier=microchipDIRECT; ComponentLink6Description: http://www.microchip.com/mymicrochip/filehandler.aspx?ddocname=en023833&src-supplier=microchipDIRECT; ComponentLink7URL: http://www.microchip.com/mymicrochip/filehandler.aspx?ddocname=en023833&src-supplier=SOS+electronic; ComponentLink7Description: http://www.microchip.com/mymicrochip/filehandler.aspx?ddocname=en023833&src-supplier=SOS+electronic